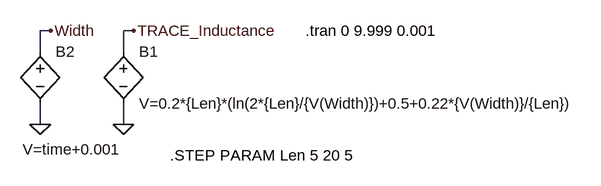
[diagram p0: schematic Fig_11-7_PCB_Inductance_CALC-2.asc]
Fig_11-7_PCB_Inductance_CALC-2.asc, the LTspice schematic file:
Version 4
SHEET 1 1108 680
WIRE 16 128 0 128
WIRE 144 128 128 128
WIRE 0 160 0 128
WIRE 128 160 128 128
WIRE 0 272 0 240
WIRE 128 272 128 240
FLAG 128 272 0
FLAG 144 128 TRACE_Inductance
FLAG 0 272 0
FLAG 16 128 Width
SYMBOL bv 128 144 R0
SYMATTR InstName B1
SYMATTR Value V=0.2*{Len}*(ln(2*{Len}/{V(Width)})+0.5+0.22*{V(Width)}/{Len})
SYMBOL bv 0 144 R0
WINDOW 3 -27 167 Left 2
SYMATTR Value V=time+0.001
SYMATTR InstName B2
TEXT 200 320 Left 2 !.STEP PARAM Len 5 20 5
TEXT 408 128 Left 2 !.tran 0 9.999 0.001

The netlist it stands for:
* Fig_11-7_PCB_Inductance_CALC-2.asc
B1 TRACE_Inductance 0 V=0.2*{Len}*(ln(2*{Len}/{V(Width)})+0.5+0.22*{V(Width)}/{Len})
B2 Width 0 V=time+0.001
.STEP PARAM Len 5 20 5
.tran 0 9.999 0.001
.backanno
.end